# EAGLE schematic 48knobs (EAGLE 8.3.2)
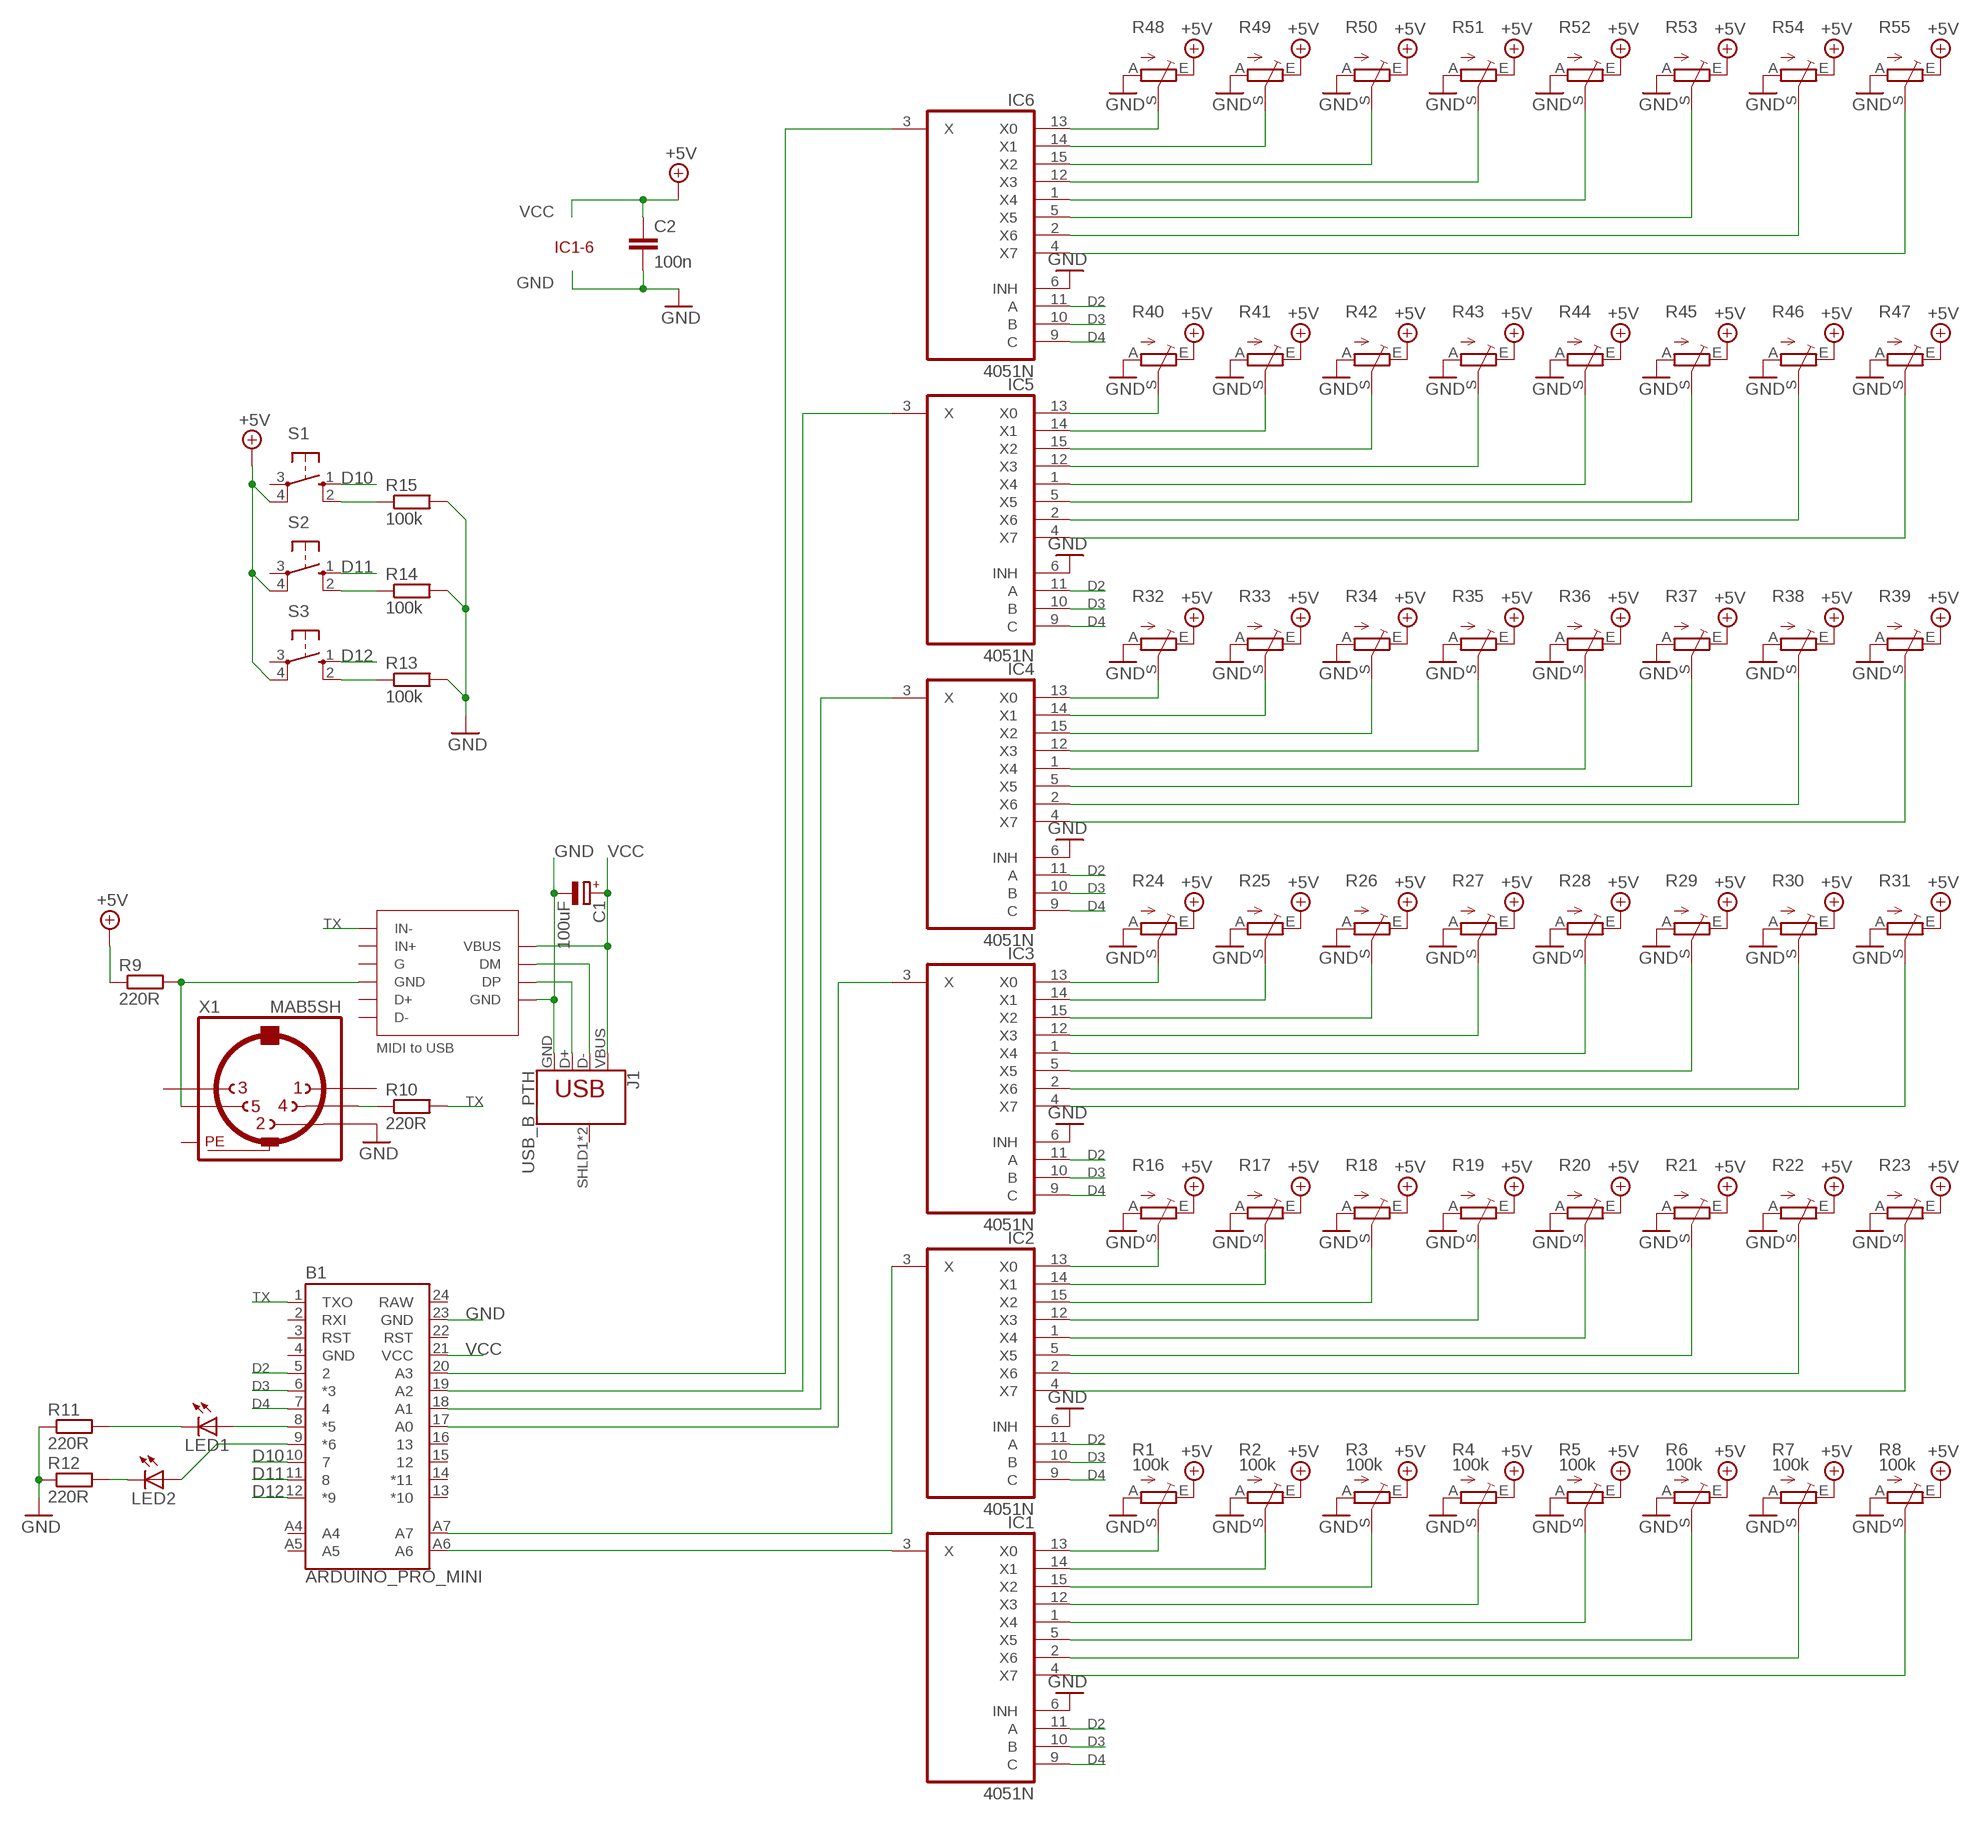
[diagram p0: schematic, sheet 1]

## Parts
B1  ARDUINO_PRO_MINI  [ARDUINO_PRO_MINI]
C1  100uF  CPOL-EUE1.8-4  [E1,8-4]
C2  100n  C2,5-3  [C2.5-3]
IC1  4051N  [DIL16]
IC2  4051N  [DIL16]
IC3  4051N  [DIL16]
IC4  4051N  [DIL16]
IC5  4051N  [DIL16]
IC6  4051N  [DIL16]
J1  USB_B_PTH  [USB-B-PTH]
LED1  LED3MM  [LED3MM]
LED2  LED3MM  [LED3MM]
R1  100k  TRIM_EU-B25U  [B25U]
R2  100k  TRIM_EU-B25U  [B25U]
R3  100k  TRIM_EU-B25U  [B25U]
R4  100k  TRIM_EU-B25U  [B25U]
R5  100k  TRIM_EU-B25U  [B25U]
R6  100k  TRIM_EU-B25U  [B25U]
R7  100k  TRIM_EU-B25U  [B25U]
R8  100k  TRIM_EU-B25U  [B25U]
R9  220R  R-EU_0204/5  [0204/5]
R10  220R  R-EU_0204/5  [0204/5]
R11  220R  R-EU_0204/5  [0204/5]
R12  220R  R-EU_0204/5  [0204/5]
R13  100k  R-EU_0204/5  [0204/5]
R14  100k  R-EU_0204/5  [0204/5]
R15  100k  R-EU_0204/5  [0204/5]
R16  TRIM_EU-B25U  [B25U]
R17  TRIM_EU-B25U  [B25U]
R18  TRIM_EU-B25U  [B25U]
R19  TRIM_EU-B25U  [B25U]
R20  TRIM_EU-B25U  [B25U]
R21  TRIM_EU-B25U  [B25U]
R22  TRIM_EU-B25U  [B25U]
R23  TRIM_EU-B25U  [B25U]
R24  TRIM_EU-B25U  [B25U]
R25  TRIM_EU-B25U  [B25U]
R26  TRIM_EU-B25U  [B25U]
R27  TRIM_EU-B25U  [B25U]
R28  TRIM_EU-B25U  [B25U]
R29  TRIM_EU-B25U  [B25U]
R30  TRIM_EU-B25U  [B25U]
R31  TRIM_EU-B25U  [B25U]
R32  TRIM_EU-B25U  [B25U]
R33  TRIM_EU-B25U  [B25U]
R34  TRIM_EU-B25U  [B25U]
R35  TRIM_EU-B25U  [B25U]
R36  TRIM_EU-B25U  [B25U]
R37  TRIM_EU-B25U  [B25U]
R38  TRIM_EU-B25U  [B25U]
R39  TRIM_EU-B25U  [B25U]
R40  TRIM_EU-B25U  [B25U]
R41  TRIM_EU-B25U  [B25U]
R42  TRIM_EU-B25U  [B25U]
R43  TRIM_EU-B25U  [B25U]
R44  TRIM_EU-B25U  [B25U]
R45  TRIM_EU-B25U  [B25U]
R46  TRIM_EU-B25U  [B25U]
R47  TRIM_EU-B25U  [B25U]
R48  TRIM_EU-B25U  [B25U]
R49  TRIM_EU-B25U  [B25U]
R50  TRIM_EU-B25U  [B25U]
R51  TRIM_EU-B25U  [B25U]
R52  TRIM_EU-B25U  [B25U]
R53  TRIM_EU-B25U  [B25U]
R54  TRIM_EU-B25U  [B25U]
R55  TRIM_EU-B25U  [B25U]
S1  10-XX  [B3F-10XX]
S2  10-XX  [B3F-10XX]
S3  10-XX  [B3F-10XX]
X1  MAB5SH  [MAB5SH]

## Nets
+5V: R1.E R2.E R3.E R4.E R5.E R6.E R7.E R8.E R9.1 R16.E R17.E R18.E R19.E R20.E R21.E R22.E R23.E R24.E R25.E R26.E R27.E R28.E R29.E R30.E R31.E R32.E R33.E R34.E R35.E R36.E R37.E R38.E R39.E R40.E R41.E R42.E R43.E R44.E R45.E R46.E R47.E R48.E R49.E R50.E R51.E R52.E R53.E R54.E R55.E S1.4(P1) S2.4(P1) S3.4(P1)
D2: B1.5 IC1.11(A) IC2.11(A) IC3.11(A) IC4.11(A) IC5.11(A) IC6.11(A)
D3: B1.6(*3) IC1.10(B) IC2.10(B) IC3.10(B) IC4.10(B) IC5.10(B) IC6.10(B)
D4: B1.7 IC1.9(C) IC2.9(C) IC3.9(C) IC4.9(C) IC5.9(C) IC6.9(C)
D10: B1.10 S1.1(S)
D11: B1.11 S2.1(S)
D12: B1.12(*9) S3.1(S)
GND: B1.23(GND) C1.- C2.2 IC1.6(INH) IC2.6(INH) IC3.6(INH) IC4.6(INH) IC5.6(INH) IC6.6(INH) J1.GND R1.A R2.A R3.A R4.A R5.A R6.A R7.A R8.A R11.1 R12.1 R13.2 R14.2 R15.2 R16.A R17.A R18.A R19.A R20.A R21.A R22.A R23.A R24.A R25.A R26.A R27.A R28.A R29.A R30.A R31.A R32.A R33.A R34.A R35.A R36.A R37.A R38.A R39.A R40.A R41.A R42.A R43.A R44.A R45.A R46.A R47.A R48.A R49.A R50.A R51.A R52.A R53.A R54.A R55.A X1.2
N$1: IC1.13(X0) R1.S
N$2: IC1.14(X1) R2.S
N$3: IC1.15(X2) R3.S
N$4: IC1.12(X3) R4.S
N$5: IC1.1(X4) R5.S
N$6: IC1.5(X5) R6.S
N$7: IC1.2(X6) R7.S
N$8: IC1.4(X7) R8.S
N$9: R9.2 X1.5
N$10: R10.1 X1.4
N$12: J1.D+
N$13: J1.D-
N$15: B1.8(*5) LED1.A
N$16: B1.9(*6) LED2.A
N$17: LED1.K(C) R11.2
N$18: LED2.K(C) R12.2
N$19: IC2.13(X0) R16.S
N$20: R15.1 S1.2(S1)
N$21: R14.1 S2.2(S1)
N$22: R13.1 S3.2(S1)
N$23: IC2.14(X1) R17.S
N$24: IC2.15(X2) R18.S
N$25: IC2.12(X3) R19.S
N$26: IC2.1(X4) R20.S
N$27: IC2.5(X5) R21.S
N$28: IC2.2(X6) R22.S
N$29: IC2.4(X7) R23.S
N$30: IC3.13(X0) R24.S
N$31: IC3.14(X1) R25.S
N$32: IC3.15(X2) R26.S
N$33: IC3.12(X3) R27.S
N$34: IC3.1(X4) R28.S
N$35: IC3.5(X5) R29.S
N$36: IC3.2(X6) R30.S
N$37: IC3.4(X7) R31.S
N$38: IC4.13(X0) R32.S
N$39: IC4.14(X1) R33.S
N$40: IC4.15(X2) R34.S
N$41: IC4.12(X3) R35.S
N$42: IC4.1(X4) R36.S
N$43: IC4.5(X5) R37.S
N$44: IC4.2(X6) R38.S
N$45: IC4.4(X7) R39.S
N$46: IC5.13(X0) R40.S
N$47: IC5.14(X1) R41.S
N$48: IC5.15(X2) R42.S
N$49: IC5.12(X3) R43.S
N$50: IC5.1(X4) R44.S
N$51: IC5.5(X5) R45.S
N$52: IC5.2(X6) R46.S
N$53: IC5.4(X7) R47.S
N$54: IC6.13(X0) R48.S
N$55: IC6.14(X1) R49.S
N$56: IC6.15(X2) R50.S
N$57: IC6.12(X3) R51.S
N$58: IC6.1(X4) R52.S
N$59: IC6.5(X5) R53.S
N$60: IC6.2(X6) R54.S
N$61: IC6.4(X7) R55.S
N$62: B1.A6 IC1.3(X)
N$63: B1.A7 IC2.3(X)
N$64: B1.17(A0) IC3.3(X)
N$65: B1.18(A1) IC4.3(X)
N$66: B1.19(A2) IC5.3(X)
N$67: B1.20(A3) IC6.3(X)
TX: B1.1(TXO) R10.2
VCC: B1.21(VCC) C1.+ C2.1 J1.VBUS ; supply symbol labelled +5V
Unconnected: B1.2(RXI) B1.3(RST) B1.13(*10) B1.14(*11) B1.15 B1.16 B1.22(RST) B1.A4 B1.A5 J1.SHLD1(SHIELD) J1.SHLD2(SHIELD) S1.3(P) S2.3(P) S3.3(P) X1.1 X1.3

## Notes on the sheet
- IC1-6
- IN-
- IN+ | VBUS
- G | DM
- GND | DP
- D+ | GND
- D-
- MIDI to USB

## Power pins joined to a net without a drawn wire
GND: B1.4(GND) IC1.8(GND) IC2.8(GND) IC3.8(GND) IC4.8(GND) IC5.8(GND) IC6.8(GND)
PE: X1.PE X1.PE@(PE)
RAW: B1.24(RAW)
VCC: IC1.16(VCC) IC2.16(VCC) IC3.16(VCC) IC4.16(VCC) IC5.16(VCC) IC6.16(VCC)
VEE: IC1.7(VEE) IC2.7(VEE) IC3.7(VEE) IC4.7(VEE) IC5.7(VEE) IC6.7(VEE)

## Library data of the parts
B1 = SparkFun-Boards:ARDUINO_PRO_MINI: SparkFun Pro Mini Pro Mini compatible footprint. Dimensions: 0.7 x 1.3" PCB Thickness: 0.8mm SparkFun Products: 3.3V/8MHz <https://www.sparkfun.com/products/11114> 5V/16MHz <https://www.sparkfun.com/products/11113>
C1 = rcl:CPOL-EU: POLARIZED CAPACITOR, European symbol
C2 = capacitor-wima:C: CAPACITOR naming: grid - package width
IC1-IC6 = 40xx:4051: 8-channel ANALOG MULTIPLEXER
J1 = SparkFun-Connectors:USB_B: USB Type B Connector SparkFun Products: SparkFun Stepoko <https://www.sparkfun.com/products/13899> PTH; PROD_ID: CONN-08278; SF_ID: PRT-00139
LED1 LED2 = led:LED: LED OSRAM: - CHIPLED LG R971, LG N971, LY N971, LG Q971, LY Q971, LO R971, LY R971 LH N974, LH R974 LS Q976, LO Q976, LY Q976 LO Q996 - Hyper CHIPLED LW Q18S LB Q993, LB Q99A, LB R99A - SideLED LS A670, LO A670, LY A670, LG A670, LP A670 LB A673, LV A673, LT A673, LW A673 LH A674 LY A675 LS A676, LA A676, LO A676, LY A676, LW A676 LS A679, LY A679, LG A679 - Hyper Micro SIDELED® LS Y876, LA Y876, LO Y876, LY Y876 LT Y87S - SmartLED LW L88C, LW L88S LB L89C, LB L89S, LG L890 LS L89K, LO L89K, LY L89K LS L896, LA L896, LO L896, LY L896 - TOPLED LS T670, LO T670, LY T670, LG T670, LP T670 LSG T670, LSP T670, LSY T670, LOP T670, LYG T670 LG T671, LOG T671, LSG T671 LB T673, LV T673, LT T673, LW T673 LH T674 LS T676, LA T676, LO T676, LY T676, LB T676, LH T676, LSB T676, LW T676 LB T67C, LV T67C, LT T67C, LS T67K, LO T67K, LY T67K, LW E67C LS E67B, LA E67B, LO E67B, LY E67B, LB E67C, LV E67C, LT E67C LW T67C LS T679, LY T679, LG T679 LS T770, LO T770, LY T770, LG T770, LP T770 LB T773, LV T773, LT T773, LW T773 LH T774 LS E675, LA E675, LY E675, LS T675 LS T776, LA T776, LO T776, LY T776, LB T776 LHGB T686 LT T68C, LB T68C - Hyper Mini TOPLED® LB M676 - Mini TOPLED Santana® LG M470 LS M47K, LO M47K, LY M47K Source: http://www.osram.convergy.de LUXEON: - LUMILED® LXK2-PW12-R00, LXK2-PW12-S00, LXK2-PW14-U00, LXK2-PW14-V00 LXK2-PM12-R00, LXK2-PM12-S00, LXK2-PM14-U00 LXK2-PE12-Q00, LXK2-PE12-R00, LXK2-PE12-S00, LXK2-PE14-T00, LXK2-PE14-U00 LXK2-PB12-K00, LXK2-PB12-L00, LXK2-PB12-M00, LXK2-PB14-N00, LXK2-PB14-P00, LXK2-PB14-Q00 LXK2-PR12-L00, LXK2-PR12-M00, LXK2-PR14-Q00, LXK2-PR14-R00 LXK2-PD12-Q00, LXK2-PD12-R00, LXK2-PD12-S00 LXK2-PH12-R00, LXK2-PH12-S00 LXK2-PL12-P00, LXK2-PL12-Q00, LXK2-PL12-R00 Source: www.luxeon.com KINGBRIGHT: KA-3528ASYC Source: www.kingbright.com
R1-R8 R16-R55 = pot:TRIM_EU-: POTENTIOMETER
R9-R15 = resistor:R-EU_: RESISTOR, European symbol
S1-S3 = switch-omron:10-XX: OMRON SWITCH; MPN: B3F-1000; OC_FARNELL: 176432; OC_NEWARK: 36M3542
X1 = con-hirschmann:MAB5SH: Female CONNECTOR 5 pins 90 deg. with shield, horizontal (DIN 41524); OC_FARNELL: 809883; OC_NEWARK: unknown